# EAGLE schematic DWM1000_rev3_1.5mmdrill (EAGLE 8.6.0)
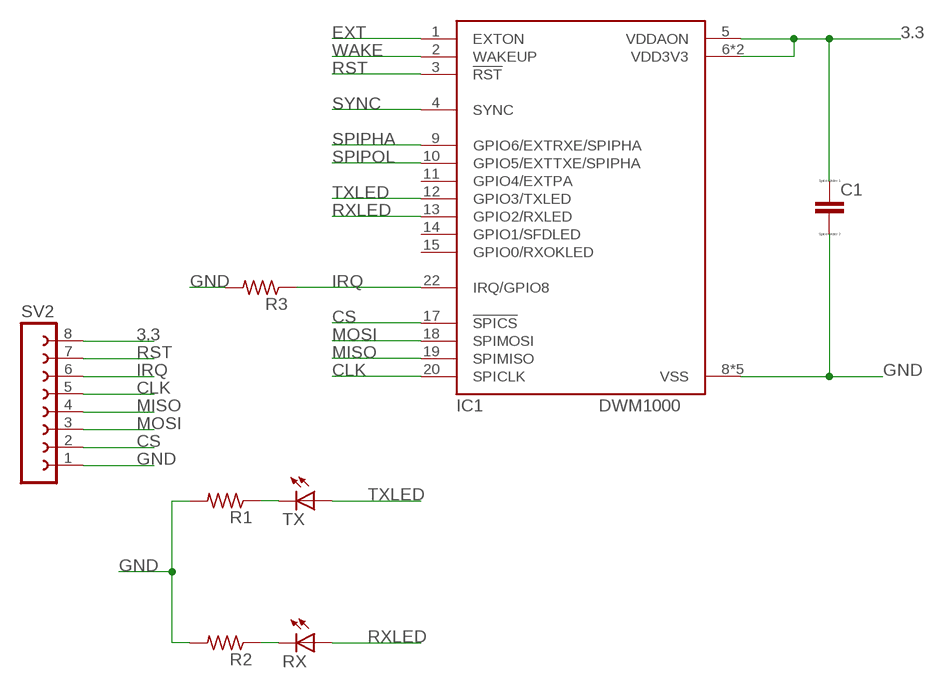
[diagram p0: schematic, sheet 1]

## Parts
C1  CC1206  [C1206]
IC1  DWM1000  [DWM1000]
R1  R-US_M0805  [M0805]
R2  R-US_M0805  [M0805]
R3  R-US_M0805  [M0805]
RX  LEDKA-3528ASYC  [KA-3528ASYC]
SV2  FE08-1  [FE08]
TX  LEDKA-3528ASYC  [KA-3528ASYC]

## Nets
3.3: C1.1 IC1.5(VDDAON) IC1.6(VDD3V3) IC1.7(VDD3V3) SV2.8
CLK: IC1.20(SPICLK) SV2.5
CS: IC1.17(!SPICS) SV2.2
EXT: IC1.1(EXTON)
GND: C1.2 IC1.8(VSS) IC1.16(VSS) IC1.21(VSS) IC1.23(VSS) IC1.24(VSS) R1.2 R2.2 R3.2 SV2.1
IRQ: IC1.22(IRQ/GPIO8) R3.1 SV2.6
MISO: IC1.19(SPIMISO) SV2.4
MOSI: IC1.18(SPIMOSI) SV2.3
N$1: R1.1 TX.C
N$2: R2.1 RX.C
RST: IC1.3(!RST) SV2.7
RXLED: IC1.13(GPIO2/RXLED) RX.A
SPIPHA: IC1.9(GPIO6/EXTRXE/SPIPHA)
SPIPOL: IC1.10(GPIO5/EXTTXE/SPIPHA)
SYNC: IC1.4(SYNC)
TXLED: IC1.12(GPIO3/TXLED) TX.A
WAKE: IC1.2(WAKEUP)
Unconnected: IC1.11(GPIO4/EXTPA) IC1.14(GPIO1/SFDLED) IC1.15(GPIO0/RXOKLED)

## Library data of the parts
C1 = eagle-ltspice:C: CAPACITOR, European symbol; SPICEMODEL: NONE; SPICEPREFIX: C
IC1 = decawave:DWM1000
R1-R3 = rcl:R-US_: RESISTOR, American symbol; SPICEPREFIX: R
RX TX = led:LED: LED OSRAM: - CHIPLED LG R971, LG N971, LY N971, LG Q971, LY Q971, LO R971, LY R971 LH N974, LH R974 LS Q976, LO Q976, LY Q976 LO Q996 - Hyper CHIPLED LW Q18S LB Q993, LB Q99A, LB R99A - SideLED LS A670, LO A670, LY A670, LG A670, LP A670 LB A673, LV A673, LT A673, LW A673 LH A674 LY A675 LS A676, LA A676, LO A676, LY A676, LW A676 LS A679, LY A679, LG A679 - Hyper Micro SIDELED® LS Y876, LA Y876, LO Y876, LY Y876 LT Y87S - SmartLED LW L88C, LW L88S LB L89C, LB L89S, LG L890 LS L89K, LO L89K, LY L89K LS L896, LA L896, LO L896, LY L896 - TOPLED LS T670, LO T670, LY T670, LG T670, LP T670 LSG T670, LSP T670, LSY T670, LOP T670, LYG T670 LG T671, LOG T671, LSG T671 LB T673, LV T673, LT T673, LW T673 LH T674 LS T676, LA T676, LO T676, LY T676, LB T676, LH T676, LSB T676, LW T676 LB T67C, LV T67C, LT T67C, LS T67K, LO T67K, LY T67K, LW E67C LS E67B, LA E67B, LO E67B, LY E67B, LB E67C, LV E67C, LT E67C LW T67C LS T679, LY T679, LG T679 LS T770, LO T770, LY T770, LG T770, LP T770 LB T773, LV T773, LT T773, LW T773 LH T774 LS E675, LA E675, LY E675, LS T675 LS T776, LA T776, LO T776, LY T776, LB T776 LHGB T686 LT T68C, LB T68C - Hyper Mini TOPLED® LB M676 - Mini TOPLED Santana® LG M470 LS M47K, LO M47K, LY M47K Source: http://www.osram.convergy.de LUXEON: - LUMILED® LXK2-PW12-R00, LXK2-PW12-S00, LXK2-PW14-U00, LXK2-PW14-V00 LXK2-PM12-R00, LXK2-PM12-S00, LXK2-PM14-U00 LXK2-PE12-Q00, LXK2-PE12-R00, LXK2-PE12-S00, LXK2-PE14-T00, LXK2-PE14-U00 LXK2-PB12-K00, LXK2-PB12-L00, LXK2-PB12-M00, LXK2-PB14-N00, LXK2-PB14-P00, LXK2-PB14-Q00 LXK2-PR12-L00, LXK2-PR12-M00, LXK2-PR14-Q00, LXK2-PR14-R00 LXK2-PD12-Q00, LXK2-PD12-R00, LXK2-PD12-S00 LXK2-PH12-R00, LXK2-PH12-S00 LXK2-PL12-P00, LXK2-PL12-Q00, LXK2-PL12-R00 Source: www.luxeon.com KINGBRIGHT: KA-3528ASYC Source: www.kingbright.com
SV2 = pin8:FE08-1: FEMALE HEADER; OC_FARNELL: unknown; OC_NEWARK: unknown